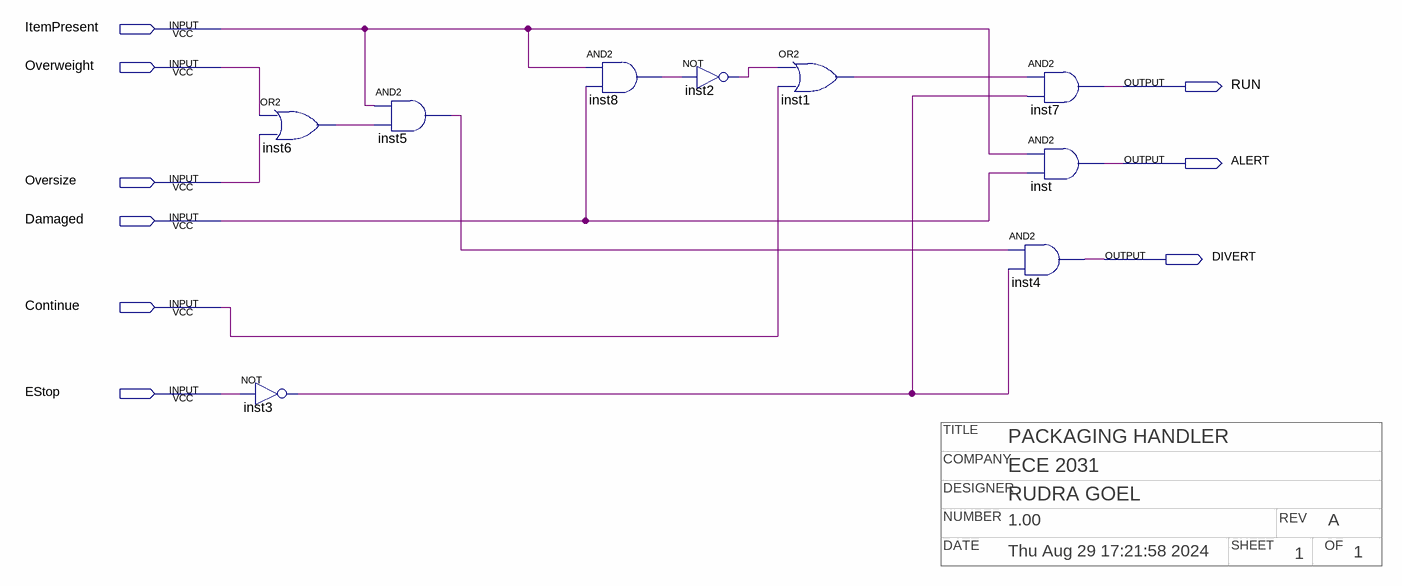
[diagram p0: schematic sheet]
// Quartus schematic Packaging.bdf as structural Verilog: 9 symbols, 9 pins
// Title block: COMPANY: ECE 2031; DATE: Thu Aug 29 17:21:58 2024; DESIGNER: RUDRA GOEL; NUMBER: 1.00; OF: 1; REV: A; SHEET: 1; TITLE: PACKAGING HANDLER
module Packaging (
  input  ItemPresent,
  input  Overweight,
  input  Oversize,
  input  Damaged,
  input  Continue,
  input  EStop,
  output RUN,
  output ALERT,
  output DIVERT
);

  wire inst1_out, inst2_out, inst3_out, inst5_out, inst6_out, inst8_out;

  not inst3 (inst3_out, EStop);
  or inst6 (inst6_out, Overweight, Oversize);
  and inst5 (inst5_out, ItemPresent, inst6_out);
  and inst8 (inst8_out, ItemPresent, Damaged);
  not inst2 (inst2_out, inst8_out);
  or inst1 (inst1_out, inst2_out, Continue);
  and inst4 (DIVERT, inst5_out, inst3_out);
  and inst7 (RUN, inst1_out, inst3_out);
  and inst (ALERT, ItemPresent, Damaged);
endmodule
